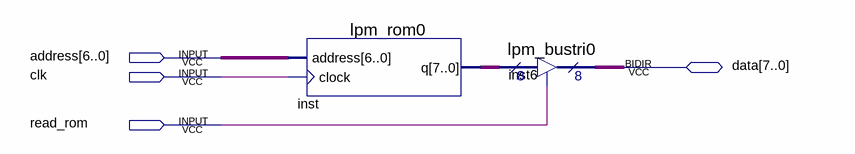
[diagram p0: schematic sheet]
// Quartus schematic rom.bdf as structural Verilog: 2 symbols, 4 pins
module rom (
  input  [6:0] address,
  input  clk,
  input  read_rom,
  inout  [7:0] data
);

  wire [7:0] inst_q;

  lpm_rom0 inst (.address(address), .clock(clk), .q(inst_q));
  lpm_bustri0 inst6 (.enabledt(read_rom), .data(inst_q), .tridata(data));
endmodule
